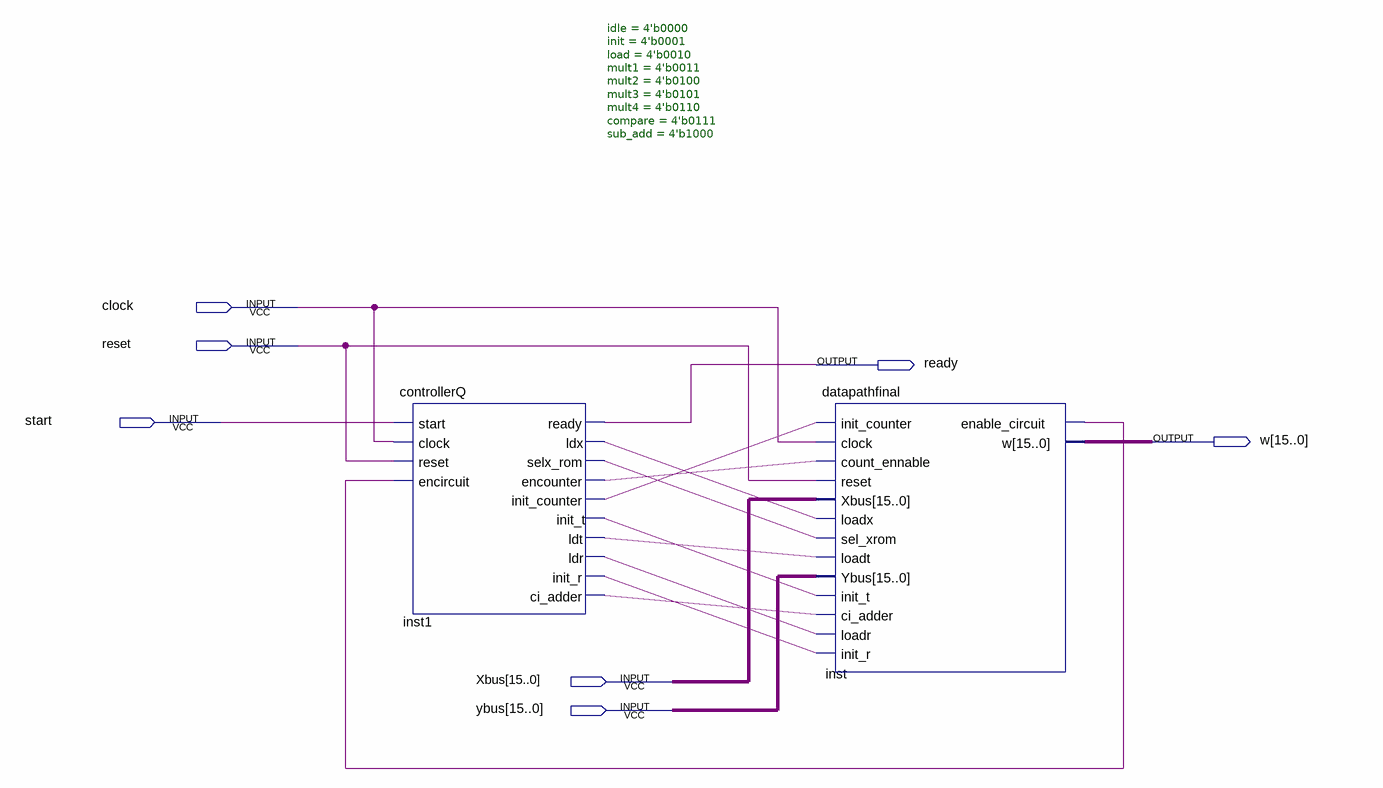
[diagram p0: schematic sheet]
// Quartus schematic circuitfinal.bdf as structural Verilog: 2 symbols, 7 pins
module circuitfinal (
  input  clock,
  input  reset,
  input  start,
  input  [15:0] Xbus,
  input  [15:0] ybus,
  output ready,
  output [15:0] w
);

  wire inst1_ci_adder, inst1_encounter, inst1_init_counter, inst1_init_r, inst1_init_t, inst1_ldr, inst1_ldt,
       inst1_ldx, inst1_selx_rom, inst_enable_circuit;

  controllerQ #(.idle(4'b0000), .init(4'b0001), .load(4'b0010), .mult1(4'b0011), .mult2(4'b0100), .mult3(4'b0101), .mult4(4'b0110), .compare(4'b0111), .sub_add(4'b1000)) inst1 (
    .start(start), .clock(clock), .reset(reset), .encircuit(inst_enable_circuit), .ready(ready),
    .ldx(inst1_ldx), .selx_rom(inst1_selx_rom), .encounter(inst1_encounter),
    .init_counter(inst1_init_counter), .init_t(inst1_init_t), .ldt(inst1_ldt), .ldr(inst1_ldr),
    .init_r(inst1_init_r), .ci_adder(inst1_ci_adder));
  datapathfinal inst (
    .init_counter(inst1_init_counter), .clock(clock), .count_ennable(inst1_encounter), .reset(reset),
    .Xbus(Xbus), .loadx(inst1_ldx), .sel_xrom(inst1_selx_rom), .loadt(inst1_ldt), .Ybus(ybus),
    .init_t(inst1_init_t), .ci_adder(inst1_ci_adder), .loadr(inst1_ldr), .init_r(inst1_init_r),
    .enable_circuit(inst_enable_circuit), .w(w));
endmodule
